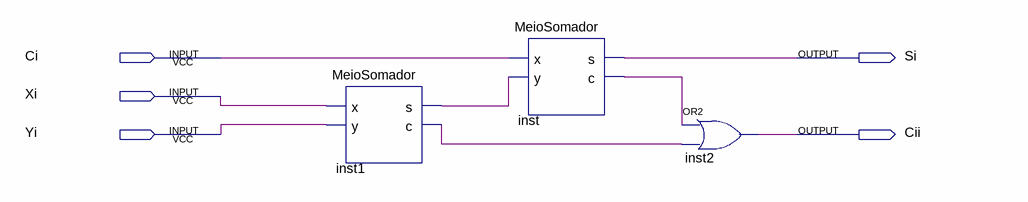
[diagram p0: schematic sheet]
// Quartus schematic SomadorCompleto.bdf as structural Verilog: 3 symbols, 5 pins
module SomadorCompleto (
  input  Ci,
  input  Xi,
  input  Yi,
  output Si,
  output Cii
);

  wire inst1_c, inst1_s, inst_c;

  MeioSomador inst1 (.x(Xi), .y(Yi), .s(inst1_s), .c(inst1_c));
  MeioSomador inst (.x(Ci), .y(inst1_s), .s(Si), .c(inst_c));
  or inst2 (Cii, inst_c, inst1_c);
endmodule
